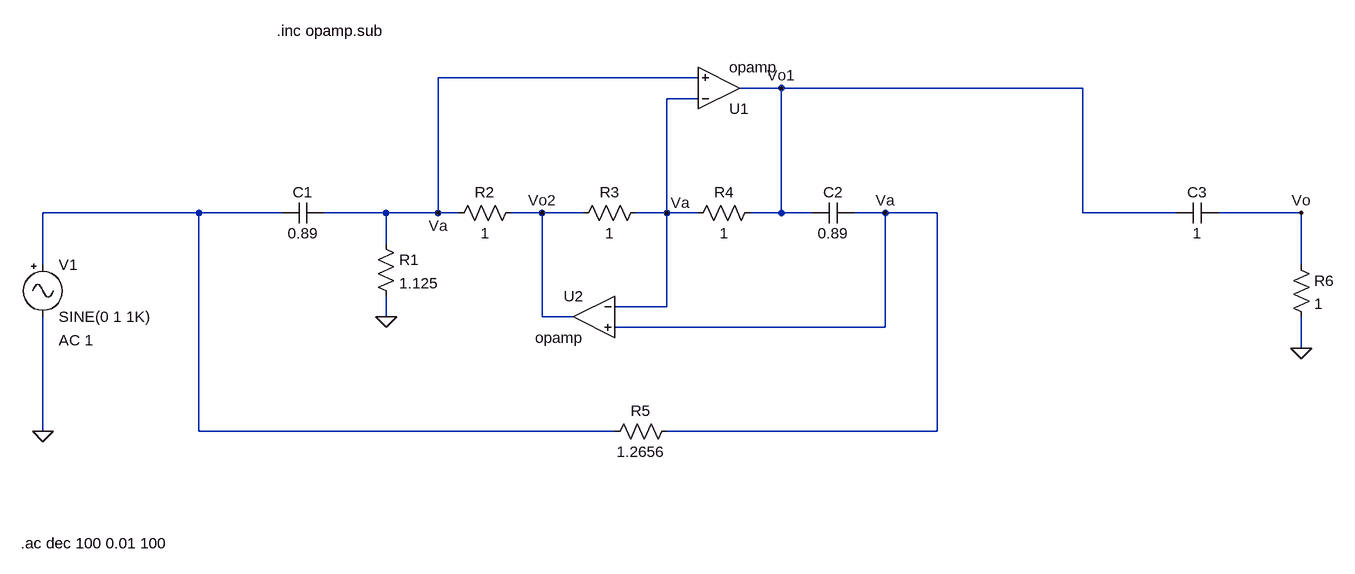
[diagram p0: schematic Simulacion Circuital.asc]
Simulacion Circuital.asc, the LTspice schematic file:
Version 4
SHEET 1 1716 680
WIRE 720 -80 320 -80
WIRE 848 -64 784 -64
WIRE 1312 -64 848 -64
WIRE 720 -48 672 -48
WIRE -48 128 -288 128
WIRE 80 128 -48 128
WIRE 240 128 144 128
WIRE 320 128 320 -80
WIRE 320 128 240 128
WIRE 352 128 320 128
WIRE 480 128 432 128
WIRE 544 128 480 128
WIRE 672 128 672 -48
WIRE 672 128 624 128
WIRE 720 128 672 128
WIRE 848 128 848 -64
WIRE 848 128 800 128
WIRE 896 128 848 128
WIRE 1008 128 960 128
WIRE 1088 128 1008 128
WIRE 1312 128 1312 -64
WIRE 1456 128 1312 128
WIRE 1648 128 1520 128
WIRE 240 176 240 128
WIRE -288 208 -288 128
WIRE 1648 208 1648 128
WIRE 672 272 672 128
WIRE 672 272 592 272
WIRE 240 288 240 256
WIRE 480 288 480 128
WIRE 528 288 480 288
WIRE 1008 304 1008 128
WIRE 1008 304 592 304
WIRE 1648 336 1648 288
WIRE -288 464 -288 288
WIRE -48 464 -48 128
WIRE 592 464 -48 464
WIRE 1088 464 1088 128
WIRE 1088 464 672 464
FLAG 240 288 0
FLAG -288 464 0
FLAG 1648 336 0
FLAG 1648 128 Vo
FLAG 848 -64 Vo1
FLAG 480 128 Vo2
FLAG 320 128 Va
FLAG 672 128 Va
FLAG 1008 128 Va
SYMBOL cap 144 112 R90
WINDOW 0 0 32 VBottom 2
WINDOW 3 32 32 VTop 2
SYMATTR InstName C1
SYMATTR Value 0.89
SYMBOL res 224 160 R0
SYMATTR InstName R1
SYMATTR Value 1.125
SYMBOL res 448 112 R90
WINDOW 0 0 56 VBottom 2
WINDOW 3 32 56 VTop 2
SYMATTR InstName R2
SYMATTR Value 1
SYMBOL res 640 112 R90
WINDOW 0 0 56 VBottom 2
WINDOW 3 32 56 VTop 2
SYMATTR InstName R3
SYMATTR Value 1
SYMBOL res 816 112 R90
WINDOW 0 0 56 VBottom 2
WINDOW 3 32 56 VTop 2
SYMATTR InstName R4
SYMATTR Value 1
SYMBOL cap 960 112 R90
WINDOW 0 0 32 VBottom 2
WINDOW 3 32 32 VTop 2
SYMATTR InstName C2
SYMATTR Value 0.89
SYMBOL OpAmps\\opamp 752 0 M180
SYMATTR InstName U1
SYMBOL OpAmps\\opamp 560 224 M0
SYMATTR InstName U2
SYMBOL res 688 448 R90
WINDOW 0 0 56 VBottom 2
WINDOW 3 32 56 VTop 2
SYMATTR InstName R5
SYMATTR Value 1.2656
SYMBOL Misc\\signal -288 192 R0
WINDOW 123 24 132 Left 2
WINDOW 39 0 0 Left 0
SYMATTR InstName V1
SYMATTR Value2 AC 1
SYMBOL cap 1520 112 R90
WINDOW 0 0 32 VBottom 2
WINDOW 3 32 32 VTop 2
SYMATTR InstName C3
SYMATTR Value 1
SYMBOL res 1632 192 R0
SYMATTR InstName R6
SYMATTR Value 1
TEXT 72 -152 Left 2 !.inc opamp.sub
TEXT -322 636 Left 2 !.ac dec 100 0.01 100

The netlist it stands for:
* Simulacion Circuital.asc
C1 Va N001 0.89
R1 Va 0 1.125
R2 Vo2 Va 1
R3 Va Vo2 1
R4 Vo1 Va 1
C2 Va Vo1 0.89
XU1 Va Va Vo1 opamp Aol=100K GBW=10Meg  ; pins invin noninvin out
XU2 Va Va Vo2 opamp Aol=100K GBW=10Meg  ; pins invin noninvin out
R5 Va N001 1.2656
V1 N001 0 SINE(0 1 1K) AC 1
C3 Vo Vo1 1
R6 Vo 0 1
.inc opamp.sub
.ac dec 100 0.01 100
.backanno
.end